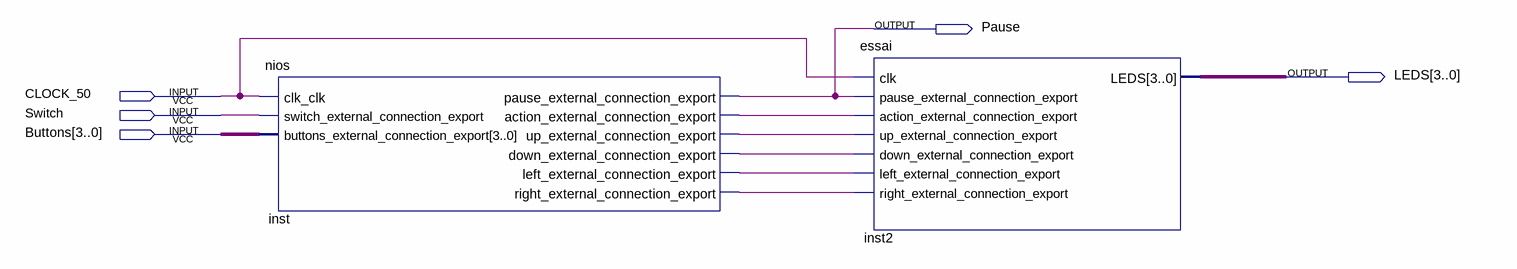
[diagram p0: schematic sheet]
// Quartus schematic Test1.bdf as structural Verilog: 2 symbols, 5 pins
module Test1 (
  input  CLOCK_50,
  input  Switch,
  input  [3:0] Buttons,
  output Pause,
  output [3:0] LEDS
);

  wire inst_action_external_connection_export, inst_down_external_connection_export,
       inst_left_external_connection_export, inst_right_external_connection_export,
       inst_up_external_connection_export;

  nios inst (
    .clk_clk(CLOCK_50), .switch_external_connection_export(Switch),
    .buttons_external_connection_export(Buttons), .pause_external_connection_export(Pause),
    .action_external_connection_export(inst_action_external_connection_export),
    .up_external_connection_export(inst_up_external_connection_export),
    .down_external_connection_export(inst_down_external_connection_export),
    .left_external_connection_export(inst_left_external_connection_export),
    .right_external_connection_export(inst_right_external_connection_export));
  essai inst2 (
    .clk(CLOCK_50), .pause_external_connection_export(Pause),
    .action_external_connection_export(inst_action_external_connection_export),
    .up_external_connection_export(inst_up_external_connection_export),
    .down_external_connection_export(inst_down_external_connection_export),
    .left_external_connection_export(inst_left_external_connection_export),
    .right_external_connection_export(inst_right_external_connection_export), .LEDS(LEDS));
endmodule
